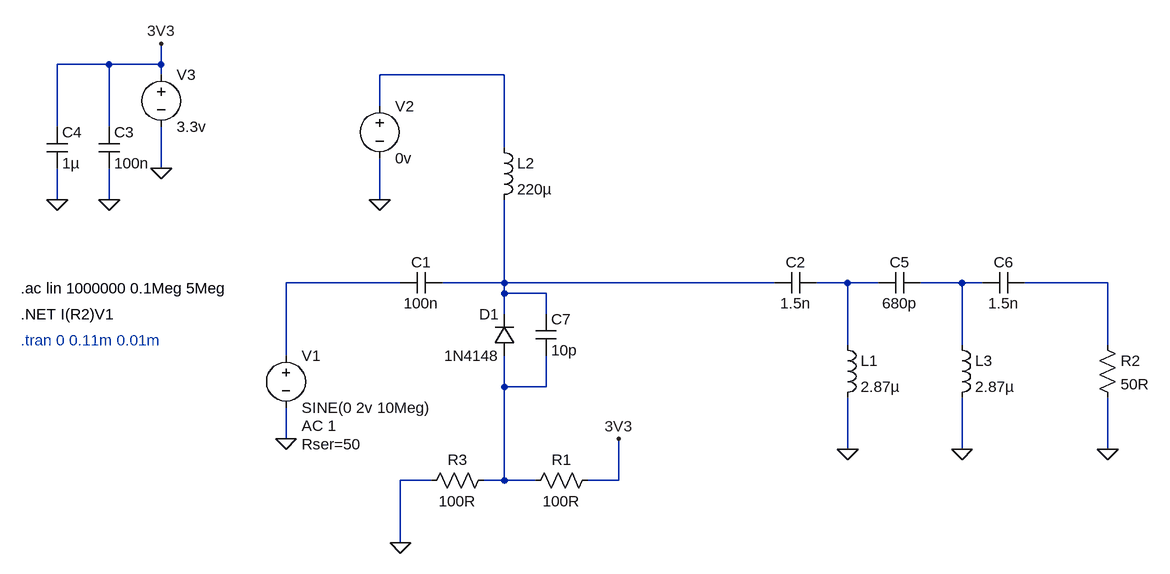
[diagram p0: schematic wspr_si5351_output_router_and_filter.asc]
wspr_si5351_output_router_and_filter.asc, the LTspice schematic file:
Version 4
SHEET 1 1396 680
WIRE -208 -352 -288 -352
WIRE -128 -352 -128 -384
WIRE -128 -352 -208 -352
WIRE -128 -336 -128 -352
WIRE 400 -336 208 -336
WIRE 208 -288 208 -336
WIRE -288 -256 -288 -352
WIRE -208 -256 -208 -352
WIRE 400 -224 400 -336
WIRE -128 -192 -128 -256
WIRE -288 -144 -288 -192
WIRE -208 -144 -208 -192
WIRE 208 -144 208 -208
WIRE 240 -16 64 -16
WIRE 400 -16 400 -144
WIRE 400 -16 304 -16
WIRE 816 -16 400 -16
WIRE 928 -16 880 -16
WIRE 976 -16 928 -16
WIRE 1104 -16 1040 -16
WIRE 1136 -16 1104 -16
WIRE 1328 -16 1200 -16
WIRE 400 0 400 -16
WIRE 464 0 400 0
WIRE 400 32 400 0
WIRE 464 32 464 0
WIRE 928 80 928 -16
WIRE 1104 80 1104 -16
WIRE 1328 80 1328 -16
WIRE 64 96 64 -16
WIRE 400 144 400 96
WIRE 464 144 464 96
WIRE 464 144 400 144
WIRE 64 224 64 176
WIRE 928 240 928 160
WIRE 1104 240 1104 160
WIRE 1328 240 1328 160
WIRE 288 288 240 288
WIRE 400 288 400 144
WIRE 400 288 368 288
WIRE 448 288 400 288
WIRE 576 288 576 224
WIRE 576 288 528 288
WIRE 240 384 240 288
FLAG 64 224 0
FLAG 208 -144 0
FLAG -128 -192 0
FLAG -288 -144 0
FLAG -208 -144 0
FLAG 928 240 0
FLAG 1104 240 0
FLAG 1328 240 0
FLAG -128 -384 3V3
FLAG 240 384 0
FLAG 576 224 3V3
SYMBOL voltage 64 80 R0
WINDOW 123 24 124 Left 2
WINDOW 39 24 152 Left 2
SYMATTR Value2 AC 1
SYMATTR SpiceLine Rser=50
SYMATTR InstName V1
SYMATTR Value SINE(0 2v 10Meg)
SYMBOL cap 304 -32 R90
WINDOW 0 0 32 VBottom 2
WINDOW 3 32 32 VTop 2
SYMATTR InstName C1
SYMATTR Value 100n
SYMBOL cap 880 -32 R90
WINDOW 0 0 32 VBottom 2
WINDOW 3 32 32 VTop 2
SYMATTR InstName C2
SYMATTR Value 1.5n
SYMBOL ind 384 -240 R0
SYMATTR InstName L2
SYMATTR Value 220µ
SYMBOL voltage 208 -304 R0
WINDOW 123 0 0 Left 0
WINDOW 39 0 0 Left 0
SYMATTR InstName V2
SYMATTR Value 0v
SYMBOL diode 416 96 R180
WINDOW 0 24 64 Left 2
WINDOW 3 24 0 Left 2
SYMATTR InstName D1
SYMATTR Value 1N4148
SYMBOL voltage -128 -352 R0
WINDOW 123 0 0 Left 0
WINDOW 39 0 0 Left 0
SYMATTR InstName V3
SYMATTR Value 3.3v
SYMBOL cap -224 -256 R0
SYMATTR InstName C3
SYMATTR Value 100n
SYMBOL cap -304 -256 R0
SYMATTR InstName C4
SYMATTR Value 1µ
SYMBOL cap 1040 -32 R90
WINDOW 0 0 32 VBottom 2
WINDOW 3 32 32 VTop 2
SYMATTR InstName C5
SYMATTR Value 680p
SYMBOL cap 1200 -32 R90
WINDOW 0 0 32 VBottom 2
WINDOW 3 32 32 VTop 2
SYMATTR InstName C6
SYMATTR Value 1.5n
SYMBOL ind 912 64 R0
SYMATTR InstName L1
SYMATTR Value 2.87µ
SYMBOL ind 1088 64 R0
SYMATTR InstName L3
SYMATTR Value 2.87µ
SYMBOL res 1312 64 R0
SYMATTR InstName R2
SYMATTR Value 50R
SYMBOL res 544 272 R90
WINDOW 0 0 56 VBottom 2
WINDOW 3 32 56 VTop 2
SYMATTR InstName R1
SYMATTR Value 100R
SYMBOL res 384 272 R90
WINDOW 0 0 56 VBottom 2
WINDOW 3 32 56 VTop 2
SYMATTR InstName R3
SYMATTR Value 100R
SYMBOL cap 448 32 R0
SYMATTR InstName C7
SYMATTR Value 10p
TEXT -344 -8 Left 2 !.ac lin 1000000 0.1Meg 5Meg
TEXT -344 32 Left 2 !.NET I(R2)V1
TEXT -344 72 Left 2 ;.tran 0 0.11m 0.01m

The netlist it stands for:
* wspr_si5351_output_router_and_filter.asc
V1 N002 0 SINE(0 2v 10Meg) AC 1 Rser=50
C1 N003 N002 100n
C2 N004 N003 1.5n
L2 N001 N003 220µ
V2 N001 0 0v
D1 N007 N003 1N4148
V3 3V3 0 3.3v
C3 3V3 0 100n
C4 3V3 0 1µ
C5 N005 N004 680p
C6 N006 N005 1.5n
L1 N004 0 2.87µ
L3 N005 0 2.87µ
R2 N006 0 50R
R1 3V3 N007 100R
R3 N007 0 100R
C7 N003 N007 10p
.model D D
.lib standard.dio
.ac lin 1000000 0.1Meg 5Meg
.NET I(R2)V1
* .tran 0 0.11m 0.01m
.backanno
.end